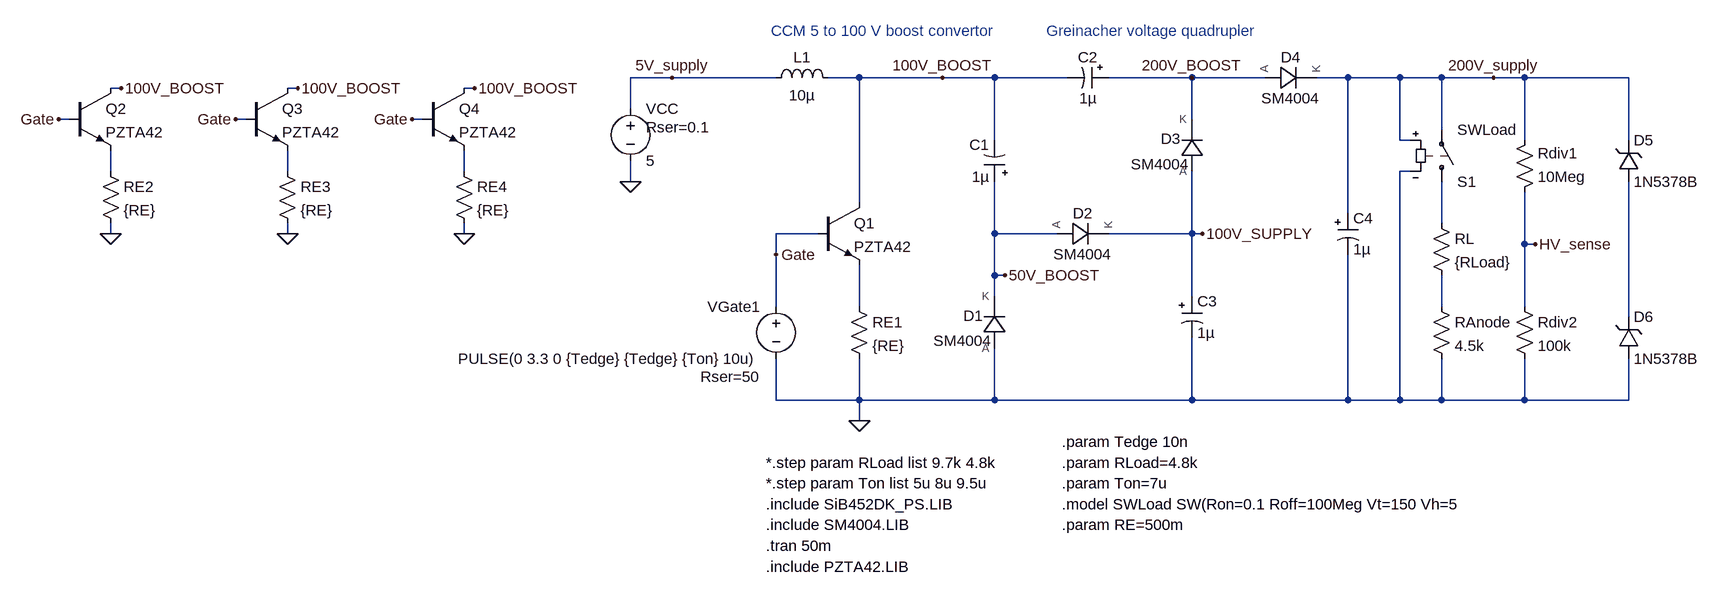
[diagram p0: schematic HV_supply_quadrupler.asc]
HV_supply_quadrupler.asc, the LTspice schematic file:
Version 4
SHEET 1 2108 1316
WIRE 96 -112 32 -112
WIRE 256 -112 96 -112
WIRE 384 -112 336 -112
WIRE 512 -112 384 -112
WIRE 592 -112 512 -112
WIRE 704 -112 592 -112
WIRE 896 -112 768 -112
WIRE 1008 -112 896 -112
WIRE 1136 -112 1088 -112
WIRE 1216 -112 1136 -112
WIRE 1280 -112 1216 -112
WIRE 1360 -112 1280 -112
WIRE 1408 -112 1360 -112
WIRE 1568 -112 1408 -112
WIRE -752 -96 -768 -96
WIRE -480 -96 -496 -96
WIRE -208 -96 -224 -96
WIRE 32 -64 32 -112
WIRE -832 -48 -848 -48
WIRE -560 -48 -576 -48
WIRE -288 -48 -304 -48
WIRE 896 -48 896 -112
WIRE 1280 -32 1280 -112
WIRE 592 -16 592 -112
WIRE 1216 -16 1216 -112
WIRE 1232 -16 1216 -16
WIRE 1408 -16 1408 -112
WIRE 1568 -16 1568 -112
WIRE -768 32 -768 0
WIRE -496 32 -496 0
WIRE -224 32 -224 0
WIRE 1232 32 1216 32
WIRE 32 48 32 16
WIRE 384 80 384 -112
WIRE 1136 96 1136 -112
WIRE 1280 112 1280 48
WIRE -768 128 -768 112
WIRE -496 128 -496 112
WIRE -224 128 -224 112
WIRE 320 128 256 128
WIRE 592 128 592 48
WIRE 688 128 592 128
WIRE 896 128 896 32
WIRE 896 128 768 128
WIRE 912 128 896 128
WIRE 1408 144 1408 64
WIRE 1424 144 1408 144
WIRE 256 160 256 128
WIRE 592 192 592 128
WIRE 608 192 592 192
WIRE 592 224 592 192
WIRE 896 224 896 128
WIRE 256 240 256 160
WIRE 384 240 384 176
WIRE 1280 240 1280 192
WIRE 1408 240 1408 144
WIRE 1568 256 1568 48
WIRE 256 384 256 320
WIRE 384 384 384 320
WIRE 384 384 256 384
WIRE 592 384 592 304
WIRE 592 384 384 384
WIRE 896 384 896 288
WIRE 896 384 592 384
WIRE 1136 384 1136 160
WIRE 1136 384 896 384
WIRE 1216 384 1216 32
WIRE 1216 384 1136 384
WIRE 1280 384 1280 320
WIRE 1280 384 1216 384
WIRE 1408 384 1408 320
WIRE 1408 384 1280 384
WIRE 1568 384 1568 320
WIRE 1568 384 1408 384
WIRE 384 416 384 384
FLAG 384 416 0
FLAG 96 -112 5V_supply
FLAG 512 -112 100V_BOOST
FLAG 896 -112 200V_BOOST
FLAG 1424 144 HV_sense
FLAG 32 48 0
FLAG 1360 -112 200V_supply
FLAG 912 128 100V_SUPPLY
FLAG 608 192 50V_BOOST
FLAG 256 160 Gate
FLAG -848 -48 Gate
FLAG -768 128 0
FLAG -752 -96 100V_BOOST
FLAG -576 -48 Gate
FLAG -496 128 0
FLAG -480 -96 100V_BOOST
FLAG -304 -48 Gate
FLAG -224 128 0
FLAG -208 -96 100V_BOOST
SYMBOL voltage 256 224 M0
WINDOW 123 0 0 Left 0
WINDOW 39 24 124 Left 2
SYMATTR SpiceLine Rser=50
SYMATTR InstName VGate1
SYMATTR Value PULSE(0 3.3 0 {Tedge} {Tedge} {Ton} 10u)
SYMBOL res 1392 80 M180
WINDOW 0 36 76 Left 2
WINDOW 3 36 40 Left 2
SYMATTR InstName Rdiv1
SYMATTR Value 10Meg
SYMBOL res 1392 224 R0
SYMATTR InstName Rdiv2
SYMATTR Value 100k
SYMBOL voltage 32 -80 R0
WINDOW 123 0 0 Left 0
WINDOW 39 24 44 Left 2
SYMATTR SpiceLine Rser=0.1
SYMATTR InstName VCC
SYMATTR Value 5
SYMBOL res 1264 224 R0
SYMATTR InstName RAnode
SYMATTR Value 4.5k
SYMBOL polcap 608 48 R180
WINDOW 0 24 57 Left 2
WINDOW 3 24 8 Left 2
SYMATTR InstName C1
SYMATTR Value 1µ
SYMATTR SpiceLine V=250
SYMBOL polcap 768 -128 R90
WINDOW 0 0 32 VBottom 2
WINDOW 3 32 32 VTop 2
SYMATTR InstName C2
SYMATTR Value 1µ
SYMATTR SpiceLine V=250
SYMBOL polcap 880 224 R0
SYMATTR InstName C3
SYMATTR Value 1µ
SYMATTR SpiceLine V=250
SYMBOL polcap 1120 96 R0
SYMATTR InstName C4
SYMATTR Value 1µ
SYMATTR SpiceLine V=250
SYMBOL sw 1280 64 M180
SYMATTR InstName S1
SYMATTR Value SWLoad
SYMBOL res 1264 96 R0
SYMATTR InstName RL
SYMATTR Value {RLoad}
SYMBOL ind 240 -96 R270
WINDOW 0 32 56 VTop 2
WINDOW 3 5 56 VBottom 2
SYMATTR InstName L1
SYMATTR Value 10µ
SYMATTR SpiceLine Ipk=6.3 Rser=19.5m Rpar=10.5K Cpar=0 mfg="Bourns, Inc." pn="SRR1280-100M"
SYMBOL npn 320 80 R0
SYMATTR InstName Q1
SYMATTR Value PZTA42
SYMATTR SpiceLine Vrrm=400 Vrsm=400 Ir=5u Irsm=5u Vf=1.1 Ifav=1 Rs=.05 trr=1500n Cj=10p Eg=1.11 Xti=3
SYMATTR Prefix X
SYMBOL npn -832 -96 R0
SYMATTR InstName Q2
SYMATTR Value PZTA42
SYMATTR Prefix X
SYMBOL zener 1552 48 M180
WINDOW 0 24 64 Left 2
WINDOW 3 24 0 Left 2
SYMATTR InstName D5
SYMATTR Value 1N5378B
SYMBOL zener 1552 320 M180
WINDOW 0 24 64 Left 2
WINDOW 3 24 0 Left 2
SYMATTR InstName D6
SYMATTR Value 1N5378B
SYMBOL res 368 224 R0
SYMATTR InstName RE1
SYMATTR Value {RE}
SYMBOL res -784 16 R0
SYMATTR InstName RE2
SYMATTR Value {RE}
SYMBOL npn -560 -96 R0
SYMATTR InstName Q3
SYMATTR Value PZTA42
SYMATTR Prefix X
SYMBOL res -512 16 R0
SYMATTR InstName RE3
SYMATTR Value {RE}
SYMBOL npn -288 -96 R0
SYMATTR InstName Q4
SYMATTR Value PZTA42
SYMATTR Prefix X
SYMBOL res -240 16 R0
SYMATTR InstName RE4
SYMATTR Value {RE}
SYMBOL sm4004 592 272 R0
WINDOW 0 -48 -18 Left 2
WINDOW 3 -94 21 Left 2
WINDOW 39 48 32 Invisible 2
SYMATTR InstName D1
SYMBOL sm4004 720 128 R90
WINDOW 0 -16 -8 VBottom 2
WINDOW 3 16 -8 VTop 2
WINDOW 39 31 -8 Invisible 2
SYMATTR InstName D2
SYMBOL sm4004 896 0 R0
WINDOW 0 -48 -18 Left 2
WINDOW 3 -94 21 Left 2
WINDOW 39 48 32 Invisible 2
SYMATTR InstName D3
SYMBOL sm4004 1040 -112 R90
WINDOW 0 -16 -8 VBottom 2
WINDOW 3 16 -8 VTop 2
WINDOW 39 31 -8 Invisible 2
SYMATTR InstName D4
TEXT 240 608 Left 2 !.tran 50m
TEXT 240 576 Left 2 !.include SM4004.LIB
TEXT 240 512 Left 2 !*.step param Ton list 5u 8u 9.5u
TEXT 672 -184 Left 2 ;Greinacher voltage quadrupler
TEXT 248 -184 Left 2 ;CCM 5 to 100 V boost convertor
TEXT 240 544 Left 2 !.include SiB452DK_PS.LIB
TEXT 696 512 Left 2 !.param Ton=7u
TEXT 696 544 Left 2 !.model SWLoad SW(Ron=0.1 Roff=100Meg Vt=150 Vh=5
TEXT 696 480 Left 2 !.param RLoad=4.8k
TEXT 240 480 Left 2 !*.step param RLoad list 9.7k 4.8k
TEXT 696 448 Left 2 !.param Tedge 10n
TEXT 240 640 Left 2 !.include PZTA42.LIB
TEXT 696 576 Left 2 !.param RE=500m

The netlist it stands for:
* HV_supply_quadrupler.asc
VGate1 Gate 0 PULSE(0 3.3 0 {Tedge} {Tedge} {Ton} 10u) Rser=50
Rdiv1 HV_sense 200V_supply 10Meg
Rdiv2 HV_sense 0 100k
VCC 5V_supply 0 5 Rser=0.1
RAnode N006 0 4.5k
C1 50V_BOOST 100V_BOOST 1µ V=250
C2 200V_BOOST 100V_BOOST 1µ V=250
C3 100V_SUPPLY 0 1µ V=250
C4 200V_supply 0 1µ V=250
S1 N004 200V_supply 200V_supply 0 SWLoad
RL N004 N006 {RLoad}
L1 5V_supply 100V_BOOST 10µ Ipk=6.3 Rser=19.5m Rpar=10.5K Cpar=0 mfg="Bourns, Inc." pn="SRR1280-100M"
XQ1 100V_BOOST Gate N005 PZTA42 Vrrm=400 Vrsm=400 Ir=5u Irsm=5u Vf=1.1 Ifav=1 Rs=.05 trr=1500n Cj=10p Eg=1.11 Xti=3  ; pins C B E
XQ2 100V_BOOST Gate N001 PZTA42  ; pins C B E
D5 N007 200V_supply 1N5378B
D6 0 N007 1N5378B
RE1 N005 0 {RE}
RE2 N001 0 {RE}
XQ3 100V_BOOST Gate N002 PZTA42  ; pins C B E
RE3 N002 0 {RE}
XQ4 100V_BOOST Gate N003 PZTA42  ; pins C B E
RE4 N003 0 {RE}
XD1 0 50V_BOOST SM4004 Vrrm=400 Vrsm=400 Ir=5u Irsm=5u Vf=1.1 Ifav=1 Rs=.05 trr=1500n Cj=10p Eg=1.11 Xti=3  ; pins A K
XD2 50V_BOOST 100V_SUPPLY SM4004 Vrrm=400 Vrsm=400 Ir=5u Irsm=5u Vf=1.1 Ifav=1 Rs=.05 trr=1500n Cj=10p Eg=1.11 Xti=3  ; pins A K
XD3 100V_SUPPLY 200V_BOOST SM4004 Vrrm=400 Vrsm=400 Ir=5u Irsm=5u Vf=1.1 Ifav=1 Rs=.05 trr=1500n Cj=10p Eg=1.11 Xti=3  ; pins A K
XD4 200V_BOOST 200V_supply SM4004 Vrrm=400 Vrsm=400 Ir=5u Irsm=5u Vf=1.1 Ifav=1 Rs=.05 trr=1500n Cj=10p Eg=1.11 Xti=3  ; pins A K
.model D D
.lib standard.dio
.tran 50m
.include SM4004.LIB
*.step param Ton list 5u 8u 9.5u
* Greinacher voltage quadrupler
* CCM 5 to 100 V boost convertor
.include SiB452DK_PS.LIB
.param Ton=7u
.model SWLoad SW(Ron=0.1 Roff=100Meg Vt=150 Vh=5
.param RLoad=4.8k
*.step param RLoad list 9.7k 4.8k
.param Tedge 10n
.include PZTA42.LIB
.param RE=500m
.lib sm4004.lib
.backanno
.end